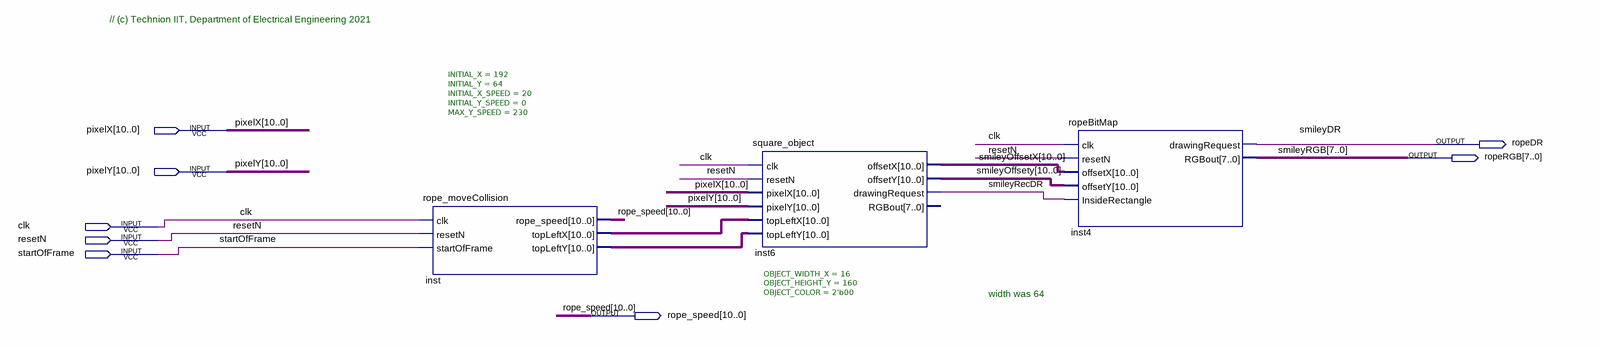
[diagram p0: schematic sheet]
// Quartus schematic Rope_Block.bdf as structural Verilog: 3 symbols, 8 pins
module Rope_Block (
  input  [10:0] pixelX,
  input  [10:0] pixelY,
  input  clk,
  input  resetN,
  input  startOfFrame,
  output ropeDR,
  output [7:0] ropeRGB,
  output [10:0] rope_speed
);

  wire smileyRecDR;
  wire [10:0] inst_topleftx, inst_toplefty, smileyOffsetX, smileyOffsety;

  rope_moveCollision #(.INITIAL_X(192), .INITIAL_Y(64), .INITIAL_X_SPEED(20), .INITIAL_Y_SPEED(0), .MAX_Y_SPEED(230)) inst (
    .clk(clk), .resetN(resetN), .startOfFrame(startOfFrame), .rope_speed(rope_speed),
    .topLeftX(inst_topleftx), .topLeftY(inst_toplefty));
  square_object #(.OBJECT_WIDTH_X(16), .OBJECT_HEIGHT_Y(160), .OBJECT_COLOR(2'b00)) inst6 (
    .clk(clk), .resetN(resetN), .pixelX(pixelX), .pixelY(pixelY), .topLeftX(inst_topleftx),
    .topLeftY(inst_toplefty), .offsetX(smileyOffsetX), .offsetY(smileyOffsety), .drawingRequest(smileyRecDR));  // open: RGBout
  ropeBitMap inst4 (
    .clk(clk), .resetN(resetN), .offsetX(smileyOffsetX), .offsetY(smileyOffsety),
    .InsideRectangle(smileyRecDR), .drawingRequest(ropeDR), .RGBout(ropeRGB));

  // Other names for the same wires on the sheet: smileyDR = ropeDR; smileyRGB[7:0] = ropeRGB

  // Notes on the sheet:
  //   // (c) Technion IIT, Department of Electrical Engineering 2021
  //   width was 64
endmodule
